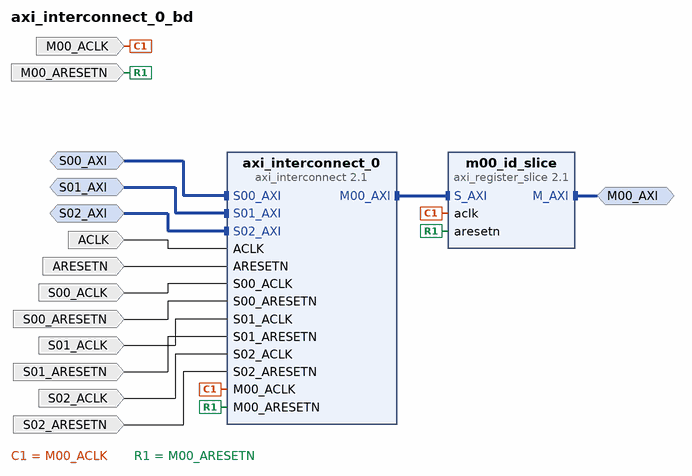
[diagram p0: block diagram of the top level]
# Vivado block design axi_interconnect_0_bd, xc7a200tfbg676-2, Vivado 2025.2
create_bd_design axi_interconnect_0_bd

create_bd_intf_port -mode Slave -vlnv xilinx.com:interface:aximm_rtl:1.0 S00_AXI
set_property -dict [list \
  CONFIG.ADDR_WIDTH 32 \
  CONFIG.ARUSER_WIDTH 0 \
  CONFIG.AWUSER_WIDTH 0 \
  CONFIG.BUSER_WIDTH 0 \
  CONFIG.DATA_WIDTH 32 \
  CONFIG.HAS_BRESP 1 \
  CONFIG.HAS_BURST 1 \
  CONFIG.HAS_CACHE 1 \
  CONFIG.HAS_LOCK 1 \
  CONFIG.HAS_PROT 1 \
  CONFIG.HAS_QOS 1 \
  CONFIG.HAS_REGION 1 \
  CONFIG.HAS_RRESP 1 \
  CONFIG.HAS_WSTRB 1 \
  CONFIG.ID_WIDTH 4 \
  CONFIG.MAX_BURST_LENGTH 256 \
  CONFIG.NUM_READ_OUTSTANDING 4 \
  CONFIG.NUM_READ_THREADS 16 \
  CONFIG.NUM_WRITE_OUTSTANDING 4 \
  CONFIG.NUM_WRITE_THREADS 16 \
  CONFIG.PROTOCOL AXI4 \
  CONFIG.READ_WRITE_MODE READ_WRITE \
  CONFIG.RUSER_BITS_PER_BYTE 0 \
  CONFIG.RUSER_WIDTH 0 \
  CONFIG.SUPPORTS_NARROW_BURST 1 \
  CONFIG.WUSER_BITS_PER_BYTE 0 \
  CONFIG.WUSER_WIDTH 0 \
] [get_bd_intf_ports S00_AXI]
create_bd_intf_port -mode Slave -vlnv xilinx.com:interface:aximm_rtl:1.0 S01_AXI
set_property -dict [list \
  CONFIG.ADDR_WIDTH 32 \
  CONFIG.ARUSER_WIDTH 0 \
  CONFIG.AWUSER_WIDTH 0 \
  CONFIG.BUSER_WIDTH 0 \
  CONFIG.DATA_WIDTH 32 \
  CONFIG.HAS_BRESP 1 \
  CONFIG.HAS_BURST 1 \
  CONFIG.HAS_CACHE 1 \
  CONFIG.HAS_LOCK 1 \
  CONFIG.HAS_PROT 1 \
  CONFIG.HAS_QOS 1 \
  CONFIG.HAS_REGION 1 \
  CONFIG.HAS_RRESP 1 \
  CONFIG.HAS_WSTRB 1 \
  CONFIG.ID_WIDTH 4 \
  CONFIG.MAX_BURST_LENGTH 256 \
  CONFIG.NUM_READ_OUTSTANDING 2 \
  CONFIG.NUM_READ_THREADS 16 \
  CONFIG.NUM_WRITE_OUTSTANDING 2 \
  CONFIG.NUM_WRITE_THREADS 16 \
  CONFIG.PROTOCOL AXI4 \
  CONFIG.READ_WRITE_MODE READ_WRITE \
  CONFIG.RUSER_BITS_PER_BYTE 0 \
  CONFIG.RUSER_WIDTH 0 \
  CONFIG.SUPPORTS_NARROW_BURST 1 \
  CONFIG.WUSER_BITS_PER_BYTE 0 \
  CONFIG.WUSER_WIDTH 0 \
] [get_bd_intf_ports S01_AXI]
create_bd_intf_port -mode Slave -vlnv xilinx.com:interface:aximm_rtl:1.0 S02_AXI
set_property -dict [list \
  CONFIG.ADDR_WIDTH 32 \
  CONFIG.ARUSER_WIDTH 0 \
  CONFIG.AWUSER_WIDTH 0 \
  CONFIG.BUSER_WIDTH 0 \
  CONFIG.DATA_WIDTH 64 \
  CONFIG.HAS_BRESP 1 \
  CONFIG.HAS_BURST 1 \
  CONFIG.HAS_CACHE 1 \
  CONFIG.HAS_LOCK 1 \
  CONFIG.HAS_PROT 1 \
  CONFIG.HAS_QOS 1 \
  CONFIG.HAS_REGION 1 \
  CONFIG.HAS_RRESP 1 \
  CONFIG.HAS_WSTRB 1 \
  CONFIG.ID_WIDTH 4 \
  CONFIG.MAX_BURST_LENGTH 256 \
  CONFIG.NUM_READ_OUTSTANDING 2 \
  CONFIG.NUM_READ_THREADS 16 \
  CONFIG.NUM_WRITE_OUTSTANDING 2 \
  CONFIG.NUM_WRITE_THREADS 16 \
  CONFIG.PROTOCOL AXI4 \
  CONFIG.READ_WRITE_MODE READ_WRITE \
  CONFIG.RUSER_BITS_PER_BYTE 0 \
  CONFIG.RUSER_WIDTH 0 \
  CONFIG.SUPPORTS_NARROW_BURST 1 \
  CONFIG.WUSER_BITS_PER_BYTE 0 \
  CONFIG.WUSER_WIDTH 0 \
] [get_bd_intf_ports S02_AXI]
create_bd_intf_port -mode Master -vlnv xilinx.com:interface:aximm_rtl:1.0 M00_AXI
set_property -dict [list \
  CONFIG.ADDR_WIDTH 32 \
  CONFIG.DATA_WIDTH 32 \
  CONFIG.NUM_READ_OUTSTANDING 8 \
  CONFIG.NUM_WRITE_OUTSTANDING 8 \
  CONFIG.PROTOCOL AXI4 \
] [get_bd_intf_ports M00_AXI]
create_bd_port -dir I -type clk ACLK
set_property -dict {CONFIG.ASSOCIATED_RESET ARESETN CONFIG.FREQ_HZ 10000000} [get_bd_ports ACLK]
create_bd_port -dir I -type rst ARESETN
create_bd_port -dir I -type clk S00_ACLK
set_property -dict {CONFIG.ASSOCIATED_RESET S00_ARESETN} [get_bd_ports S00_ACLK]
create_bd_port -dir I -type rst S00_ARESETN
create_bd_port -dir I -type clk S01_ACLK
set_property -dict {CONFIG.ASSOCIATED_RESET S01_ARESETN} [get_bd_ports S01_ACLK]
create_bd_port -dir I -type rst S01_ARESETN
create_bd_port -dir I -type clk S02_ACLK
set_property -dict {CONFIG.ASSOCIATED_RESET S02_ARESETN} [get_bd_ports S02_ACLK]
create_bd_port -dir I -type rst S02_ARESETN
create_bd_port -dir I -type clk M00_ACLK
set_property -dict {CONFIG.ASSOCIATED_RESET M00_ARESETN} [get_bd_ports M00_ACLK]
create_bd_port -dir I -type rst M00_ARESETN

create_bd_cell -type ip -vlnv xilinx.com:ip:axi_interconnect:2.1 axi_interconnect_0
set_property -dict [list \
  CONFIG.M00_HAS_DATA_FIFO 2 \
  CONFIG.NUM_MI 1 \
  CONFIG.NUM_SI 3 \
  CONFIG.S00_HAS_DATA_FIFO 2 \
  CONFIG.S01_HAS_DATA_FIFO 2 \
  CONFIG.S02_HAS_DATA_FIFO 2 \
  CONFIG.STRATEGY 2 \
  CONFIG.XBAR_DATA_WIDTH 32 \
] [get_bd_cells axi_interconnect_0]
create_bd_cell -type ip -vlnv xilinx.com:ip:axi_register_slice:2.1 m00_id_slice
set_property -dict {CONFIG.ADDR_WIDTH 32 CONFIG.DATA_WIDTH 32 CONFIG.ID_WIDTH 6 CONFIG.PROTOCOL AXI4} [get_bd_cells m00_id_slice]

# ---- connections ----

connect_bd_intf_net -intf_net S00_AXI_0_1 [get_bd_intf_ports S00_AXI] [get_bd_intf_pins axi_interconnect_0/S00_AXI]
connect_bd_intf_net -intf_net S01_AXI_0_1 [get_bd_intf_ports S01_AXI] [get_bd_intf_pins axi_interconnect_0/S01_AXI]
connect_bd_intf_net -intf_net S02_AXI_0_1 [get_bd_intf_ports S02_AXI] [get_bd_intf_pins axi_interconnect_0/S02_AXI]
connect_bd_intf_net [get_bd_intf_pins axi_interconnect_0/M00_AXI] [get_bd_intf_pins m00_id_slice/S_AXI]
connect_bd_intf_net [get_bd_intf_ports M00_AXI] [get_bd_intf_pins m00_id_slice/M_AXI]
connect_bd_net -net ACLK_0_1 [get_bd_ports ACLK] [get_bd_pins axi_interconnect_0/ACLK]
connect_bd_net -net ARESETN_0_1 [get_bd_ports ARESETN] [get_bd_pins axi_interconnect_0/ARESETN]
connect_bd_net -net M00_ACLK_0_1 [get_bd_ports M00_ACLK] [get_bd_pins axi_interconnect_0/M00_ACLK] [get_bd_pins m00_id_slice/aclk]
connect_bd_net -net M00_ARESETN_0_1 [get_bd_ports M00_ARESETN] [get_bd_pins axi_interconnect_0/M00_ARESETN] [get_bd_pins m00_id_slice/aresetn]
connect_bd_net -net S00_ACLK_0_1 [get_bd_ports S00_ACLK] [get_bd_pins axi_interconnect_0/S00_ACLK]
connect_bd_net -net S00_ARESETN_0_1 [get_bd_ports S00_ARESETN] [get_bd_pins axi_interconnect_0/S00_ARESETN]
connect_bd_net -net S01_ACLK_0_1 [get_bd_ports S01_ACLK] [get_bd_pins axi_interconnect_0/S01_ACLK]
connect_bd_net -net S01_ARESETN_0_1 [get_bd_ports S01_ARESETN] [get_bd_pins axi_interconnect_0/S01_ARESETN]
connect_bd_net -net S02_ACLK_0_1 [get_bd_ports S02_ACLK] [get_bd_pins axi_interconnect_0/S02_ACLK]
connect_bd_net -net S02_ARESETN_0_1 [get_bd_ports S02_ARESETN] [get_bd_pins axi_interconnect_0/S02_ARESETN]

# ---- address map ----
assign_bd_address -offset 0x00000000 -range 4G -target_address_space [get_bd_addr_spaces S00_AXI] [get_bd_addr_segs M00_AXI/Reg]
assign_bd_address -offset 0x00000000 -range 4G -target_address_space [get_bd_addr_spaces S01_AXI] [get_bd_addr_segs M00_AXI/Reg]
assign_bd_address -offset 0x00000000 -range 4G -target_address_space [get_bd_addr_spaces S02_AXI] [get_bd_addr_segs M00_AXI/Reg]

validate_bd_design
save_bd_design
